# EAGLE design Rectifier+different voltages (EAGLE 9.2.0)
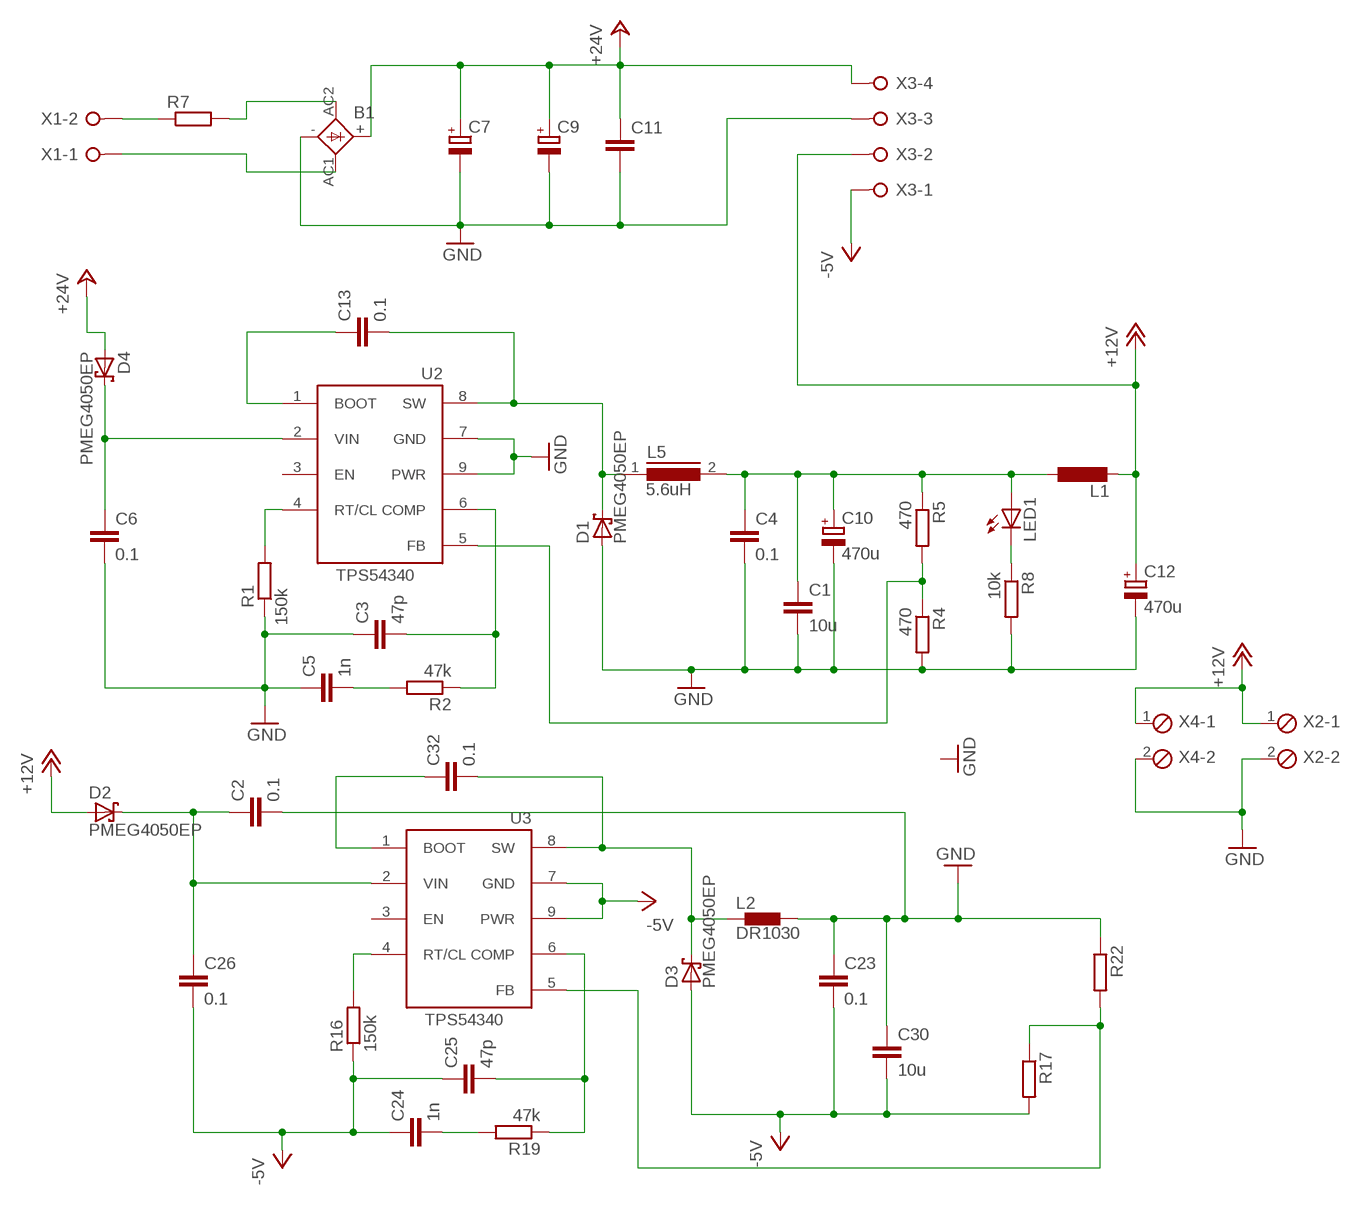
[diagram p0: schematic, sheet 1]

## Parts
B1  KBL  [KBL]
C1  10u  C-EUC1206  [C1206]
C2  0.1  C-EUC1210  [C1210]
C3  47p  C-EUC0603K  [C0603K]
C4  0.1  C-EUC1206  [C1206]
C5  1n  C-EUC0603K  [C0603K]
C6  0.1  C-EUC1206  [C1206]
C7  CPOL-EUE7.5-18  [E7,5-18]
C9  CPOL-EUE7.5-18  [E7,5-18]
C10  470u  CPOL-EUE5-10.5  [E5-10,5]
C11  C-EUC1206  [C1206]
C12  470u  CPOL-EUE5-10.5  [E5-10,5]
C13  0.1  C-EU102-043X133  [C102-043X133]
C23  0.1  C-EUC1206  [C1206]
C24  1n  C-EUC0603K  [C0603K]
C25  47p  C-EUC0603K  [C0603K]
C26  0.1  C-EUC1210  [C1210]
C30  10u  C-EUC1206  [C1206]
C32  0.1  C-EU075-032X103  [C075-032X103]
D1  PMEG4050EP  [SOD128]
D2  PMEG4050EP  [SOD128]
D3  PMEG4050EP  [SOD128]
D4  PMEG4050EP  [SOD128]
L1  L-EU0207/5V  [0207/5V]
L2  DR1030  [DR1030]
L5  5.6uH  DR125  [DR125]
LED1  LEDB152  [Q62902-B152]
R1  150k  R-EU_R1206  [R1206]
R2  47k  R-EU_R0603  [R0603]
R4  470  R-EU_R1206  [R1206]
R5  470  R-EU_R1206  [R1206]
R7  R-EU_0207/10  [0207/10]
R8  10k  R-EU_R0603  [R0603]
R16  150k  R-EU_R1206  [R1206]
R17  R-EU_R1206  [R1206]
R19  47k  R-EU_R0603  [R0603]
R22  R-EU_R1206  [R1206]
U2  TPS54340  TPS54340SO8  [HSOP]
U3  TPS54340SO8  [HSOP]
X1  W237-02P  [W237-132]
X2  MPT2  [2POL254]
X3  W237-04P  [W237-4P]
X4  MPT2  [2POL254]

## Nets
+12V: C12.+ D2.2(A) L1.2 X2.1 X3.2 X4.1
+24V: B1.+ C7.+ C9.+ C11.1 D4.2(A) X3.4
-5V: C23.2 C24.1 C25.1 C26.2 C30.2 D3.2(A) R16.1 R17.2 U3.7(GND) U3.9(PWR) X3.1
GND: B1.- C1.2 C2.2 C3.1 C4.2 C5.1 C6.2 C7.- C9.- C10.- C11.2 C12.- C23.1 C30.1 D1.2(A) L2.2 R1.1 R4.2 R8.2 R22.1 U2.7(GND) U2.9(PWR) X2.2 X3.3 X4.2
N$1: R1.2 U2.4(RT/CL)
N$2: C5.2 R2.2
N$3: C3.2 R2.1 U2.6(COMP)
N$4: R7.1 X1.2
N$5: R4.1 R5.2 U2.5(FB)
N$6: LED1.K(C) R8.1
N$7: C2.1 C26.1 D2.1(K) U3.2(VIN)
N$8: C6.1 D4.1(K) U2.2(VIN)
N$13: C13.1 U2.1(BOOT)
N$14: C13.2 D1.1(K) L5.1 U2.8(SW)
N$17: B1.AC1(AC2) X1.1
N$19: B1.AC2(AC1) R7.2
N$21: R17.1 R22.2 U3.5(FB)
N$22: R16.2 U3.4(RT/CL)
N$23: C25.2 R19.1 U3.6(COMP)
N$25: C1.1 C4.1 C10.+ L1.1 L5.2 LED1.A R5.1
N$26: C32.1 U3.1(BOOT)
N$27: C32.2 D3.1(K) L2.1 U3.8(SW)
N$28: C24.2 R19.2
Unconnected: U2.3(EN) U3.3(EN)

## Library data of the parts
B1 = rectifier:KBL: DIOTEC RECTIFIER
C1 C4 C6 C23 C30 = rcl:C-EU: CAPACITOR, European symbol
C2 C3 C5 C11 C13 C24-C26 C32 = rcl:C-EU: CAPACITOR, European symbol; SPICEPREFIX: C
C7 C9 C10 C12 = rcl:CPOL-EU: POLARIZED CAPACITOR, European symbol; SPICEPREFIX: C
D1-D4 = NXP_60_26022015:PMEG4050E: 40 V, 5 A low VF MEGA Schottky barrier rectifier Planar Maximum Efficiency General Application (MEGA) Schottky barrier rectifier with an integrated guard ring for stress protection. AAL Eindhoven MK
L1 = rcl:L-EU: INDUCTOR, European symbol; SPICEPREFIX: L
L2 = inductors:DR1030: DR1030 Series Low Profile Power Inductors Source: Data sheet <http://www.cooperbussmann.com/pdf/c73e479f-f867-4c64-ae26-9c1f23814163.pdf>; SPICEPREFIX: L
L5 = inductors:DR125: High Power Density, High Efficiency, Shielded Inductors Source: coiltronics_dr_series.pdf; SPICEPREFIX: L
LED1 = led:LED: LED OSRAM: - CHIPLED LG R971, LG N971, LY N971, LG Q971, LY Q971, LO R971, LY R971 LH N974, LH R974 LS Q976, LO Q976, LY Q976 LO Q996 - Hyper CHIPLED LW Q18S LB Q993, LB Q99A, LB R99A - SideLED LS A670, LO A670, LY A670, LG A670, LP A670 LB A673, LV A673, LT A673, LW A673 LH A674 LY A675 LS A676, LA A676, LO A676, LY A676, LW A676 LS A679, LY A679, LG A679 - Hyper Micro SIDELED® LS Y876, LA Y876, LO Y876, LY Y876 LT Y87S - SmartLED LW L88C, LW L88S LB L89C, LB L89S, LG L890 LS L89K, LO L89K, LY L89K LS L896, LA L896, LO L896, LY L896 - TOPLED LS T670, LO T670, LY T670, LG T670, LP T670 LSG T670, LSP T670, LSY T670, LOP T670, LYG T670 LG T671, LOG T671, LSG T671 LB T673, LV T673, LT T673, LW T673 LH T674 LS T676, LA T676, LO T676, LY T676, LB T676, LH T676, LSB T676, LW T676 LB T67C, LV T67C, LT T67C, LS T67K, LO T67K, LY T67K, LW E67C LS E67B, LA E67B, LO E67B, LY E67B, LB E67C, LV E67C, LT E67C LW T67C LS T679, LY T679, LG T679 LS T770, LO T770, LY T770, LG T770, LP T770 LB T773, LV T773, LT T773, LW T773 LH T774 LS E675, LA E675, LY E675, LS T675 LS T776, LA T776, LO T776, LY T776, LB T776 LHGB T686 LT T68C, LB T68C - Hyper Mini TOPLED® LB M676 - Mini TOPLED Santana® LG M470 LS M47K, LO M47K, LY M47K Source: http://www.osram.convergy.de LUXEON: - LUMILED® LXK2-PW12-R00, LXK2-PW12-S00, LXK2-PW14-U00, LXK2-PW14-V00 LXK2-PM12-R00, LXK2-PM12-S00, LXK2-PM14-U00 LXK2-PE12-Q00, LXK2-PE12-R00, LXK2-PE12-S00, LXK2-PE14-T00, LXK2-PE14-U00 LXK2-PB12-K00, LXK2-PB12-L00, LXK2-PB12-M00, LXK2-PB14-N00, LXK2-PB14-P00, LXK2-PB14-Q00 LXK2-PR12-L00, LXK2-PR12-M00, LXK2-PR14-Q00, LXK2-PR14-R00 LXK2-PD12-Q00, LXK2-PD12-R00, LXK2-PD12-S00 LXK2-PH12-R00, LXK2-PH12-S00 LXK2-PL12-P00, LXK2-PL12-Q00, LXK2-PL12-R00 Source: www.luxeon.com KINGBRIGHT: KA-3528ASYC Source: www.kingbright.com
R1 R4 R5 R16 R17 R22 = rcl:R-EU_: RESISTOR, European symbol
R2 R7 R8 R19 = rcl:R-EU_: RESISTOR, European symbol; SPICEPREFIX: R
U2 U3 = ProjectLibrary:TPS54340: TPS54340 42 V Input, 3.5 A, Step Down DC-DC Converter with Eco-mode™
X1 = con-wago-508:W237-02P: WAGO SREW CLAMP; OC_FARNELL: unknown; OC_NEWARK: unknown
X2 X4 = con-phoenix-254:MPT2: PHOENIX CONNECTOR; OC_FARNELL: unknown; OC_NEWARK: unknown
X3 = con-wago-508:W237-04P: WAGO SREW CLAMP; OC_FARNELL: unknown; OC_NEWARK: unknown

## Board
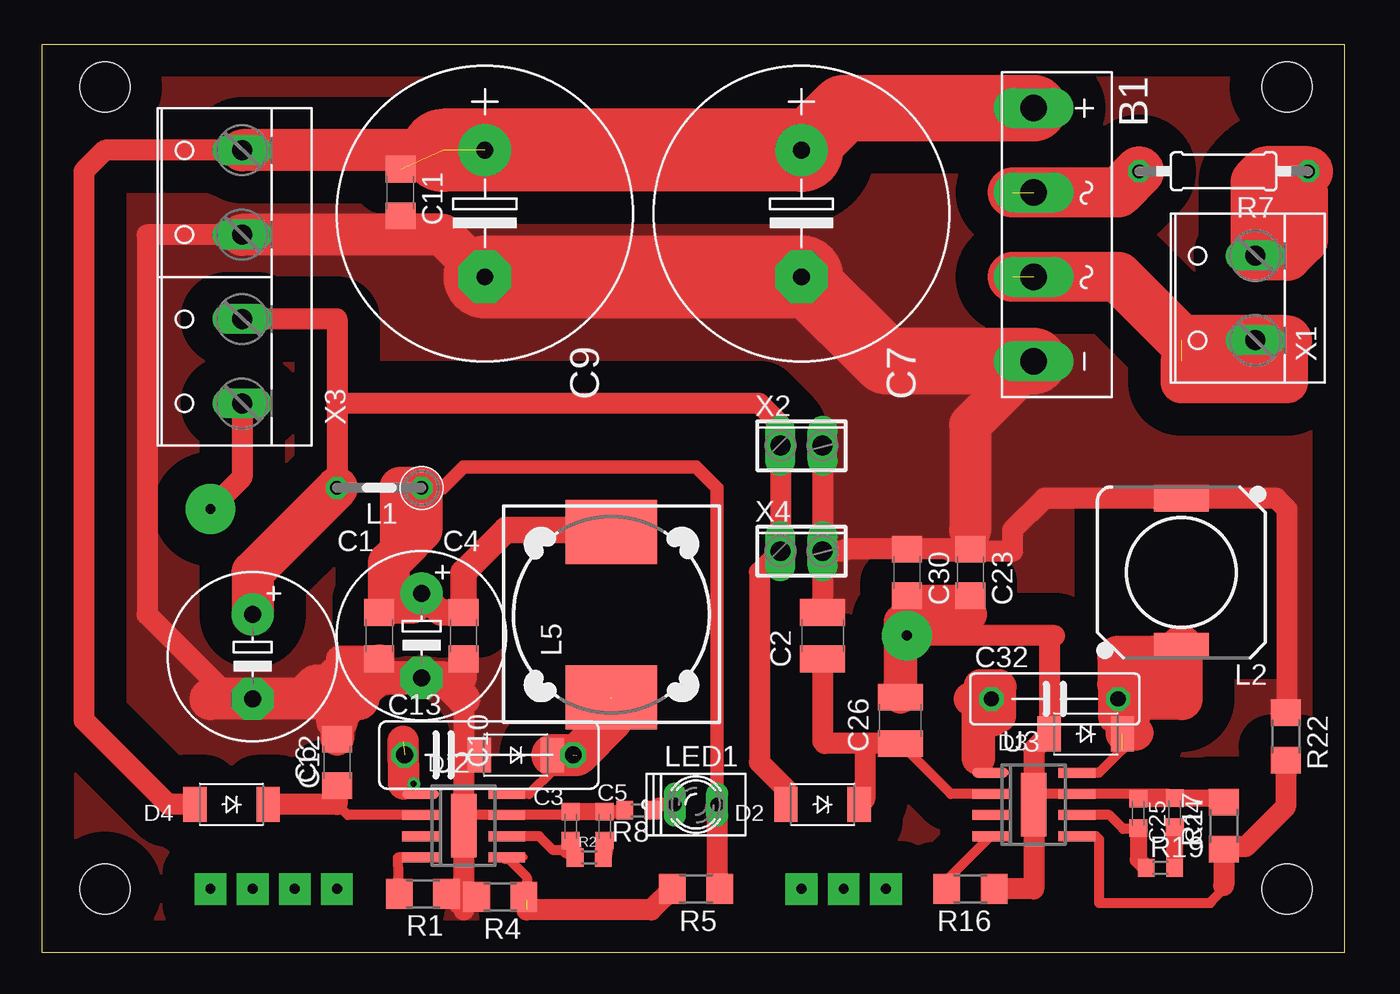
[diagram p1: board, top side]
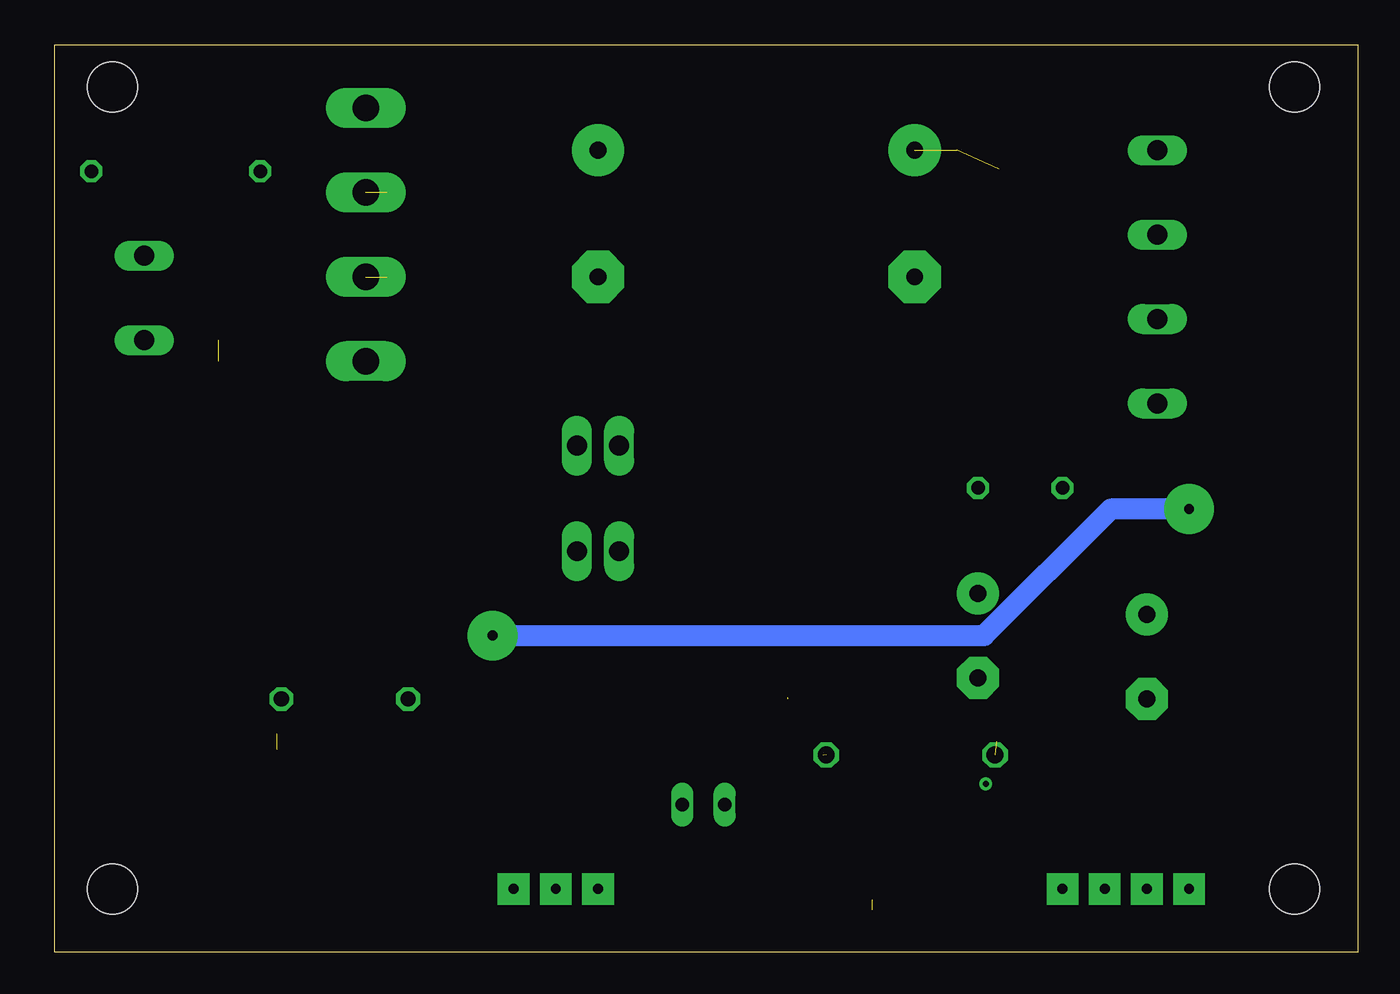
[diagram p2: board, bottom side, seen from below]

Size 78.41 x 54.6 mm. Coordinates in mm from the lower left corner, seen from the top.
Outline: 0,0 78.41,0 78.41,54.6 0,54.6 0,0
Copper layers (1*16): Top 0.035mm / dielectric 1.5mm / Bottom 0.035mm
Design rules "default": minimum track width 6mil, minimum drill 0.35mm, track to track 6mil, track to pad 6mil, pad to pad 6mil, via to via 6mil, smd to smd 6mil, copper to edge 40mil, drill to drill 6mil, minimum pad ring 10mil, minimum via ring 8mil, stop-mask expansion 4mil, vias tented up to drill 0mil, thermal gap 10mil
Holes 3 mm at 3.81,3.81 3.81,52.07 74.93,52.07 74.93,3.81

### Footprints (pad centres in the part's own frame; a part is rotated, then mirrored left to right if it is on the bottom)
KBL = drill 1.6 long: + -7.62,-1.27; - 7.62,-1.27; AC1 2.54,-1.27; AC2 -2.54,-1.27
C1206 = smd 1.6 x 1.8: 1 -1.4,0; 2 1.4,0
C1210 = smd 1.6 x 2.7: 1 -1.4,0; 2 1.4,0
C0603K = smd 1.05 x 1.08: 1 -0.875,0; 2 0.875,0
E7,5-18 = drill 1.016 pad 3.15: + -3.81,0 | drill 1.016 pad 3.15 octagon: - 3.81,0
E5-10,5 = drill 1.016 pad 2.54: + -2.54,0 | drill 1.016 pad 2.54 octagon: - 2.54,0
C102-043X133 = drill 1.016 octagon: 1 -5.08,0; 2 5.08,0
C075-032X103 = drill 0.914 octagon: 1 -3.81,0; 2 3.81,0
SOD128 = smd 1.4 x 2.1: 1 -2.2,0; 2 2.2,0
0207/5V = drill 0.813 octagon: 1 -2.54,0; 2 2.54,0
DR1030 = smd 3.3 x 1.6: 1 0,4.45; 2 0,-4.45
DR125 = smd 3.85 x 5.5: 1 -4.975,0; 2 4.975,0
Q62902-B152 = drill 0.813 long: A 1.27,0; K -1.27,0
R1206 = smd 1.6 x 1.803: 1 -1.422,0; 2 1.422,0
R0603 = smd 1 x 1.1: 1 -0.85,0; 2 0.85,0
0207/10 = drill 0.813 octagon: 1 -5.08,0; 2 5.08,0
HSOP = smd 0.6 x 2.2: 1 -1.905,-2.6; 2 -0.635,-2.6; 3 0.635,-2.6; 4 1.905,-2.6; 5 1.905,2.6; 6 0.635,2.6; 7 -0.635,2.6; 8 -1.905,2.6 | smd 3.81 x 1.524: 9 0,0
W237-132 = drill 1.194 long: 1 -2.54,-0.635; 2 2.54,-0.635
2POL254 = drill 1.2 long: 1 -1.27,0; 2 1.27,0
W237-4P = drill 1.194 long: 1 -7.62,-0.635; 2 -2.54,-0.635; 3 2.54,-0.635; 4 7.62,-0.635

### Placement (x,y rotation side)
B1  60.96,43.18 270 top
C1  20.32,19.05 270 top
C2  46.99,19.05 90 top
C3  31.84,7.58 270 top
C4  25.4,19.05 270 top
C5  33.88,7.58 270 top
C6  17.78,11.43 90 top
C7  45.72,44.45 270 top
C9  26.67,44.45 270 top
C10  22.86,19.05 270 top
C11  21.59,45.72 270 top
C12  12.7,17.78 270 top
C13  26.91,11.87 0 top
C23  55.88,22.86 270 top
C24  68.17,8.39 270 top
C25  65.98,8.36 270 top
C26  51.66,13.96 90 top
C30  52.07,22.86 270 top
C32  60.96,15.24 0 top
D1  28.54,11.86 180 top
D2  46.99,8.89 180 top
D3  62.83,13.13 180 top
D4  11.43,8.89 180 top
L1  20.32,27.94 180 top
L2  68.58,22.86 180 top
L5  34.29,20.32 90 top
LED1  39.37,8.89 0 top
R1  22.95,3.53 180 top
R2  32.94,5.7 0 top
R4  27.6,3.34 180 top
R5  39.37,3.81 180 top
R7  71.12,46.99 180 top
R8  35.94,8.55 180 top
R16  55.88,3.81 180 top
R17  71.12,7.62 90 top
R19  67.31,5.08 0 top
R22  74.85,12.99 270 top
U2  25.4,7.62 270 top
U3  59.69,8.89 270 top
X1  72.39,39.37 90 top
X2  45.72,30.48 0 top
X3  11.43,40.64 90 top
X4  45.72,24.13 0 top

### Tracks (layer width: path | path; a pad name or v marks a point on that pad's centre or on a via)
+12V
  Top 1.27: X3.2 17.78,38.1 17.78,33.02 | 17.78,33.02 L1.2 | D2.2 44.79,9.82 43.18,11.43 43.18,22.86 X4.1 X2.1 44.45,31.75 43.18,33.02 17.78,33.02
  Top 2.54: L1.2 12.7,22.86 C12.+
+24V  (2 unrouted)
  Top 1.27: X3.4 3.81,48.26 2.54,46.99 2.54,13.97 7.62,8.89 D4.2
  Top 2.54: C9.+ X3.4
  Top 4: B1.+ 48.26,50.8 C7.+
  Top 5: C7.+ 24.13,48.26
-5V  (via drill 0.6 pad 3)
  Top 0.61: U3.9 60.33,9.53 U3.7 67.84,9.53 68.14,9.23 | C25.1 65.68,9.53
  Top 1.016: C25.1 68.14,9.23 68.17,9.23 C24.1 70.89,9.27 R17.2
  Top 1.27: R16.1 59.69,3.81 U3.9 59.69,12.2 D3.2 60.63,18.72 60.96,19.05 v52.07,19.05 52.07,20.32 C30.2 C23.2 | X3.1 12.06,28.57 v10.16,26.67
  Top 2: C26.2 51.66,19.91 52.07,20.32 55.88,20.32
  Bottom 1.27: v10.16,26.67 14.87,26.67 22.49,19.05 v52.07,19.05
GND
  Top 0.61: C3.1 31.39,8.26 U2.7 26.04,8.26 U2.9
  Top 0.813: 25.4,2.54 25.08,2.85 | 25.08,2.85 R1.1 | 25.08,2.85 24.93,2.77 | R8.2 35,8.46 C5.1
  Top 1.016: C3.1 C5.1 33.9,8.46
  Top 1.27: 25.4,2.54 U2.9 25.4,12.21 | 25.4,12.21 25.54,12.34 26.02,11.86 D1.2 | 25.4,12.21 25.4,15.24 25.4,16.51 | C23.1 54.61,24.26 | 54.61,24.26 C30.1 48.39,24.26 48.26,24.13 X4.2 | 74.93,14.87 74.93,26.67 74.29,27.31 L2.2 60.33,27.31 58.42,25.4 58.42,24.13 54.74,24.13 54.61,24.26 | X4.2 C2.2 | X3.3 6.35,43.18 6.35,20.32 11.43,15.24 C12.- | X2.2 X4.2
  Top 1.6: C4.2 25.4,16.51 | 20.32,16.51 C1.2 17.91,17.65 19.05,16.51
  Top 1.8: C1.2 19.05,16.38 16.38,16.38 15.24,15.24 C12.-
  Top 2: C6.2 17.78,13.97 20.32,16.51 24.13,16.51 25.4,15.24
  Top 2.54: B1.- 55.88,31.75 55.88,25.4 | X3.3 24.13,43.18 C9.- | 19.05,16.51 19.05,15.24 10.16,15.24 | 17.78,16.51 17.78,13.97
  Top 4: B1.- 50.8,35.56 C7.-
  Top 5: C7.- C9.-
  pour Top (isolate 1.93, rank 2, no thermals): 0,54.61 78.74,54.61 78.74,0 0,0
M
  cutout Top: 62.23,26.67 75.01,26.67 75.01,16.51 64.77,16.51 62.23,19.05
N
  cutout Top (isolate 1.676, no thermals): 27.94,26.67 27.94,13.97 39.37,13.97 39.37,26.67
N$1
  Top 0.61: U2.4 21.45,5.7 R1.2
N$2
  Top 1.016: C5.2 33.87,6.24 R2.2
N$3
  Top 0.61: U2.6 29.95,6.99 30.79,6.15 31.62,6.15 C3.2
  Top 1.016: R2.1 31.97,6.39 31.68,6.17 31.62,6.15
N$4
  Top 3: R7.1 73.66,46.99 73.03,46.35 X1.2 74.93,41.91 75.89,42.87 75.89,45.72
N$5  (1 unrouted)
  Top 0.406: 27.89,5.6 U2.5 29.03,5.71
  Top 0.61: 28.61,5.68 27.89,5.6 | U2.5 29.21,4.5 29.21,3.15 R4.1
  Top 1.27: R5.2 36.68,2.54 29.21,2.54
N$6
  Top 0.813: R8.1 37.13,8.89 LED1.K
N$7
  Top 0.61: U3.2 54.7,9.53 C26.1
  Top 1.27: C2.1 46.99,12.7 47.13,12.56 49.53,12.56 | C26.1 49.53,12.56 | D2.1 49.53,9.23 49.53,12.56
N$8
  Top 0.61: U2.2 18.41,8.26 17.78,8.89
  Top 1.27: D4.1 17.78,8.89 C6.1
N$9  (via drill 0.6 pad 1.9)
  other vias: 17.78,3.81
N$10  (via drill 0.6 pad 1.9)
  other vias: 15.24,3.81
N$11  (via drill 0.35 pad 0.6)
  other vias: 22.39,10.13
N$12  (via drill 0.6 pad 1.9)
  other vias: 12.7,3.81
N$13  (1 unrouted)
  Top 0.61: U2.1 22.01,9.53 21.7,9.83 21.78,10.15
  Top 1.9: 21.78,10.15 21.74,12.7
N$14  (2 unrouted)
  Top 0.61: U2.8 29.34,9.53 30.74,10.93 D1.1
  Top 2.54: D1.1 32.18,11.86 34.29,13.97 34.29,15.24
N$15  (via drill 0.6 pad 1.9)
  other vias: 10.16,3.81
N$16  (via drill 0.6 pad 1.9)
  other vias: 45.72,3.81
N$17  (2 unrouted)
  Top 2.54: 74.93,36.83 74.93,34.29 68.58,34.29 68.58,35.56
  Top 3: 74.93,36.83 71.12,36.83 | X1.1 68.58,36.83 64.77,40.64 58.42,40.64
N$18  (via drill 0.6 pad 1.9)
  other vias: 48.26,3.81
N$19  (1 unrouted)
  Top 3: R7.2 64.77,45.72 58.42,45.72
N$20  (via drill 0.6 pad 1.9)
  other vias: 50.8,3.81
N$21
  Top 0.61: U3.5 63.44,6.99 63.61,6.81 63.61,2.97 63.64,2.95 70.26,2.95 | 70.32,2.95 70.26,2.95 | 70.26,2.95 71.12,3.81 71.12,4.03
  Top 1.016: R17.1 71.12,4.03
  Top 1.27: R22.2 74.85,8.76 72.44,6.35 71.12,6.35 71.12,4.03
N$22
  Top 0.61: U3.4 54.46,4.35 R16.2
N$23
  Top 0.61: U3.6 64.24,8.26 65.08,7.42 65.91,7.42 C25.2
  Top 1.016: C25.2 65.98,5.56 R19.1
N$25
  Top 0.813: LED1.A 40.64,27.94 39.37,29.21 25.4,29.21 24.13,27.94 L1.1
  Top 1.27: 40.64,5.99 LED1.A 40.64,3.81 R5.1
  Top 1.6: 34.19,25.4 27.94,25.4 25.4,22.86 C4.1 24,20.45 C10.+ | 20.89,21.02 C1.1
  Top 2.54: L5.2 34.19,25.4 | C10.+ 22.29,21.02 20.89,21.02 20.89,23.43 21.59,24.13 | 21.59,24.13 22.86,25.4 L1.1 21.59,27.94 21.59,24.13
N$26
  Top 0.61: U3.1 56.81,11.07 56.29,11.07 56.29,11.6 56.35,11.66
  Top 2: 56.35,11.66 56.35,14.44 C32.1 | C32.1 55.88,15.24 | C32.1 56.48,15.91 56.48,16.03 57.59,16.03 57.66,15.96 57.63,15.94 57.63,14.22 57.54,14.22 57.51,14.26 57.21,13.97 57.15,13.97
N$27  (1 unrouted)
  Top 0.61: U3.8 63.63,10.79 65.03,12.2
  Top 1.27: 67.31,15.24 65.67,15.24 C32.2 64.77,13.97
  Top 2: D3.1 65.82,13.13 65.89,13.2 65.67,13.41 65.67,15.24 65.55,15.37 65.55,16.28 65.42,16.15 64.58,16.15 64.58,14.16 64.77,13.97
  Top 2.54: 65.67,15.24 68.58,15.24 L2.1 67.95,17.78 64.77,17.78 64.77,16.14 65.55,15.37
N$28
  Top 1.016: R19.2 68.16,7.51 C24.2